# EAGLE schematic panel_schematic (EAGLE 9.6.2)
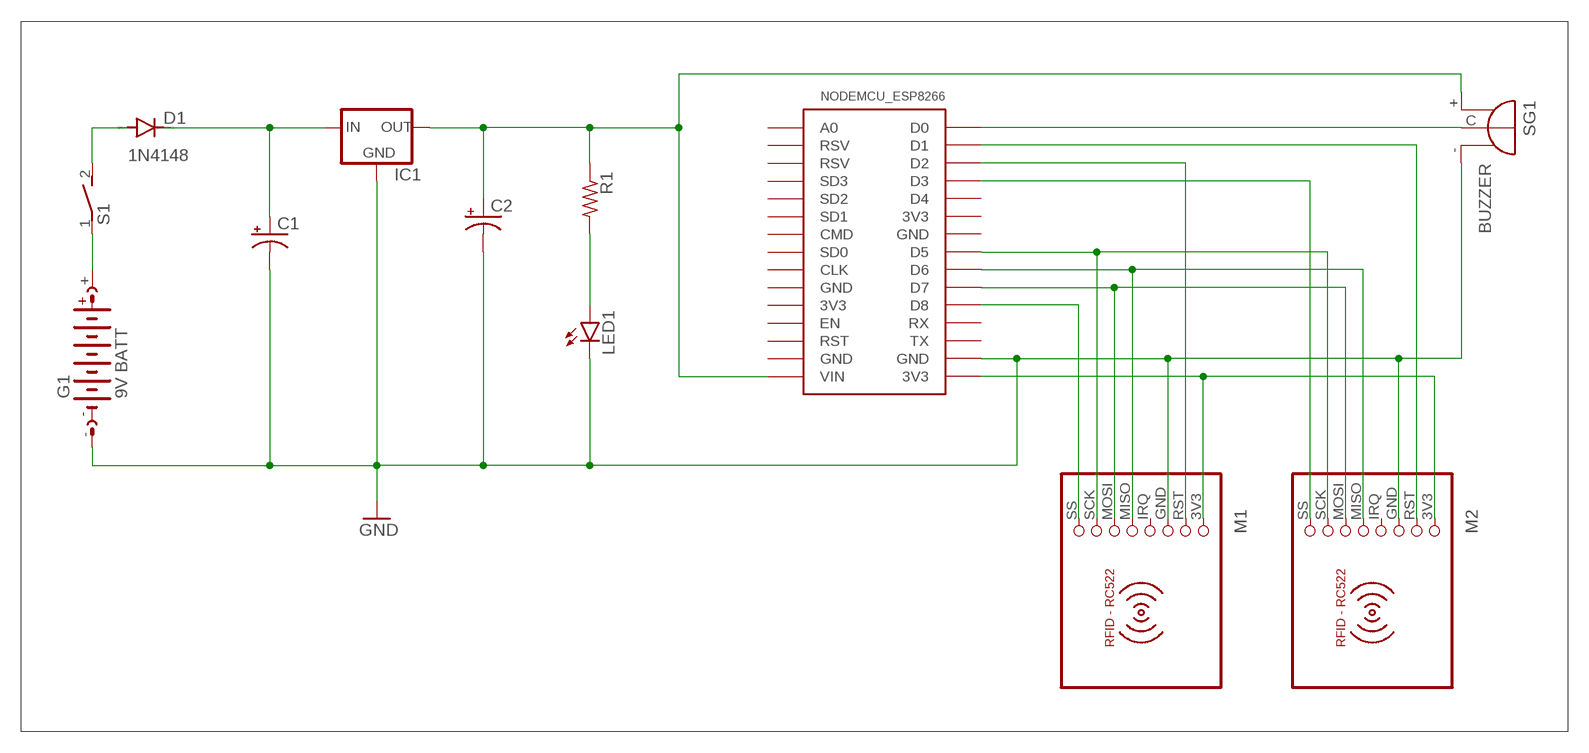
[diagram p0: schematic, sheet 1]

## Parts
C1  CPOL-USE1.8-4  [E1,8-4]
C2  CPOL-USE1.8-4  [E1,8-4]
D1  1N4148  1N4148DO35-7  [DO35-7]
G1  9V BATT  AB9V  [AB9V]
IC1  78XXS  [78XXS]
LED1  LED5MM  [LED5MM]
M1  RFID-RC522  [RFID-RC522]
M2  RFID-RC522  [RFID-RC522]
NODE1  NODEMCU_ESP8266  [NODEMCU_ESP8266]
R1  R-US_0207/10  [0207/10]
S1  DS01E  [DS-01]
SG1  BUZZER  F/KMB  [F/KMB]

## Nets
GND: C1.- C2.- G1.- IC1.GND LED1.K(C) M1.GND M2.GND NODE1.GND@1(GND) SG1.-
N$1: C2.+ IC1.OUT NODE1.VIN R1.1 SG1.+
N$3: LED1.A R1.2
N$4: C1.+ D1.C IC1.IN
N$5: M1.3V3 M2.3V3 NODE1.3V3@1(3V3)
N$6: G1.+ S1.1
N$7: D1.A S1.2
N$8: M1.SCK M2.SCK NODE1.D5
N$9: M1.MISO M2.MISO NODE1.D6
N$10: M1.MOSI M2.MOSI NODE1.D7
N$11: M1.SS NODE1.D8
N$12: M2.SS NODE1.D3
N$13: M1.RST NODE1.D2
N$14: M2.RST NODE1.D1
N$16: NODE1.D0 SG1.C(T)
Unconnected: M1.IRQ M2.IRQ NODE1.A0 NODE1.CLK NODE1.CMD NODE1.D4 NODE1.EN NODE1.RST NODE1.RSV1(RSV) NODE1.RSV2(RSV) NODE1.RX NODE1.SD1 NODE1.SD2 NODE1.SD3 NODE1.SDO(SD0) NODE1.TX

## Power pins joined to a net without a drawn wire
3V3: NODE1.3V3@2(3V3) NODE1.3V3@3(3V3)
GND: NODE1.GND@2(GND) NODE1.GND@3(GND) NODE1.GND@4(GND)

## Library data of the parts
C1 C2 = rcl:CPOL-US: POLARIZED CAPACITOR, American symbol; SPICEPREFIX: C
D1 = diode:1N4148: DIODE high speed (Philips)
G1 = battery:AB9V: 9-V BATTERY CLIP
IC1 = v-reg:78XXS: VOLTAGE REGULATOR
LED1 = led:LED: LED OSRAM: - CHIPLED LG R971, LG N971, LY N971, LG Q971, LY Q971, LO R971, LY R971 LH N974, LH R974 LS Q976, LO Q976, LY Q976 LO Q996 - Hyper CHIPLED LW Q18S LB Q993, LB Q99A, LB R99A - SideLED LS A670, LO A670, LY A670, LG A670, LP A670 LB A673, LV A673, LT A673, LW A673 LH A674 LY A675 LS A676, LA A676, LO A676, LY A676, LW A676 LS A679, LY A679, LG A679 - Hyper Micro SIDELED® LS Y876, LA Y876, LO Y876, LY Y876 LT Y87S - SmartLED LW L88C, LW L88S LB L89C, LB L89S, LG L890 LS L89K, LO L89K, LY L89K LS L896, LA L896, LO L896, LY L896 - TOPLED LS T670, LO T670, LY T670, LG T670, LP T670 LSG T670, LSP T670, LSY T670, LOP T670, LYG T670 LG T671, LOG T671, LSG T671 LB T673, LV T673, LT T673, LW T673 LH T674 LS T676, LA T676, LO T676, LY T676, LB T676, LH T676, LSB T676, LW T676 LB T67C, LV T67C, LT T67C, LS T67K, LO T67K, LY T67K, LW E67C LS E67B, LA E67B, LO E67B, LY E67B, LB E67C, LV E67C, LT E67C LW T67C LS T679, LY T679, LG T679 LS T770, LO T770, LY T770, LG T770, LP T770 LB T773, LV T773, LT T773, LW T773 LH T774 LS E675, LA E675, LY E675, LS T675 LS T776, LA T776, LO T776, LY T776, LB T776 LHGB T686 LT T68C, LB T68C - Hyper Mini TOPLED® LB M676 - Mini TOPLED Santana® LG M470 LS M47K, LO M47K, LY M47K Source: http://www.osram.convergy.de LUXEON: - LUMILED® LXK2-PW12-R00, LXK2-PW12-S00, LXK2-PW14-U00, LXK2-PW14-V00 LXK2-PM12-R00, LXK2-PM12-S00, LXK2-PM14-U00 LXK2-PE12-Q00, LXK2-PE12-R00, LXK2-PE12-S00, LXK2-PE14-T00, LXK2-PE14-U00 LXK2-PB12-K00, LXK2-PB12-L00, LXK2-PB12-M00, LXK2-PB14-N00, LXK2-PB14-P00, LXK2-PB14-Q00 LXK2-PR12-L00, LXK2-PR12-M00, LXK2-PR14-Q00, LXK2-PR14-R00 LXK2-PD12-Q00, LXK2-PD12-R00, LXK2-PD12-S00 LXK2-PH12-R00, LXK2-PH12-S00 LXK2-PL12-P00, LXK2-PL12-Q00, LXK2-PL12-R00 Source: www.luxeon.com KINGBRIGHT: KA-3528ASYC Source: www.kingbright.com
M1 M2 = mfrc522-module:RFID-RC522: RFID-RC522 MFRC-522 based breakout board
NODE1 = nodemcu_esp8266:NODEMCU_ESP8266: Node MCU V2 (ESP8266) Created by Harish
R1 = rcl:R-US_: RESISTOR, American symbol; SPICEPREFIX: R
S1 = switch-dil:DS01E: DIL/CODE SWITCH; OC_FARNELL: unknown; OC_NEWARK: unknown
SG1 = buzzer:F/KMB: BUZZER Source: Buerklin; OC_FARNELL: unknown; OC_NEWARK: unknown